# EAGLE schematic ESP12E (EAGLE 7.5.0)
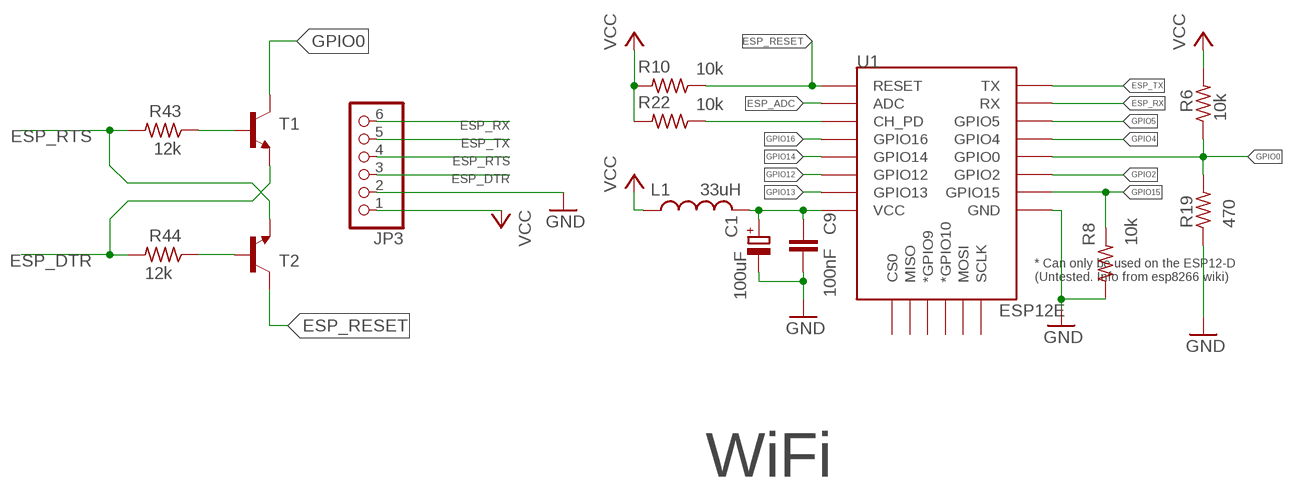
[diagram p0: schematic, sheet 1]

## Parts
C1  100uF  CPOL-EUE2,5-6E  [E2,5-6E]
C9  100nF  C-EU050-024X044  [C050-024X044]
JP3  PINHD-1X6  [1X06]
L1  33uH  L-US0207/10  [0207/10]
R6  10k  R-US_0204/7  [0204/7]
R8  10k  R-US_0204/7  [0204/7]
R10  10k  R-US_0204/7  [0204/7]
R19  470  R-US_0204/7  [0204/7]
R22  10k  R-US_0204/7  [0204/7]
R43  12k  R-US_0204/7  [0204/7]
R44  12k  R-US_0204/7  [0204/7]
T1  BC547-NPN-TO92-CBE  [TO92-CBE]
T2  BC547-NPN-TO92-CBE  [TO92-CBE]
U1  ESP12E  ESP12ESMD  [ESP12E-SMD]

## Nets
ESP_ADC: U1.ADC
ESP_DTR: JP3.3 R44.2 T1.E
ESP_RESET: R10.1 T2.C U1.RESET
ESP_RTS: JP3.4 R43.2 T2.E
ESP_RX: JP3.6 U1.RXD0(RX)
ESP_TX: JP3.5 U1.TXD0(TX)
GND: C1.- C9.2 JP3.2 R8.1 R19.1 U1.GND
GPIO0: R6.1 R19.2 T1.C U1.GPIO0
GPIO2: U1.GPIO2
GPIO4: U1.GPIO4
GPIO5: U1.GPIO5
GPIO12: U1.GPIO12
GPIO13: U1.GPIO13
GPIO14: U1.GPIO14
GPIO15: R8.2 U1.GPIO15
GPIO16: U1.GPIO16
N$4: R44.1 T2.B
N$8: R43.1 T1.B
N$10: R22.1 U1.CH_PD
SDDSDSD: C1.+ C9.1 L1.2 U1.VCC
VCC: JP3.1 L1.1 R6.2 R10.2 R22.2
Unconnected: U1.CS0 U1.GPIO9(*GPIO9) U1.GPIO10(*GPIO10) U1.MISO U1.MOSI U1.SCLK

## Notes on the sheet
- WiFi

## Library data of the parts
C1 = rcl:CPOL-EU: POLARIZED CAPACITOR, European symbol
C9 = rcl:C-EU: CAPACITOR, European symbol
JP3 = pinhead:PINHD-1X6: PIN HEADER
L1 = rcl-2:L-US: INDUCTOR, American symbol
R6 R8 R10 R19 R22 R43 R44 = resistor:R-US_: RESISTOR, American symbol
T1 T2 = transistor:*-NPN-: NPN Transistror BF959 corrected 2008.03.06
U1 = PatternAgents_RFmodules:ESP12E: ESP12E Module

## Net classes
1 vcc: width 0.254 mm